# Altium schematic sheet UART Interface.SchDoc
size A
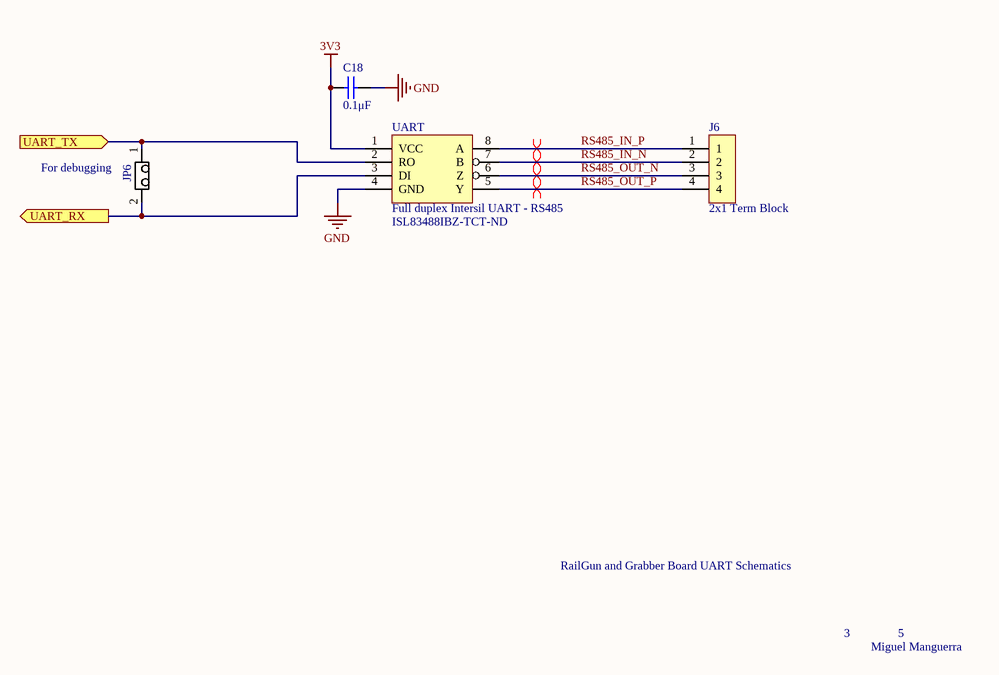
[diagram p0: UART Interface.SchDoc]

## Parts
C18  0.1μF  [CAPC1608N(0603")]
J6  2x1 Term Block  [4X1 Terminal Block]
JP6  1X2 Pin Head  [2X1 Males Header]  (value not drawn)
UART  Full duplex Intersil UART - RS485  Supplier Part Number 1: ISL83488IBZ-TCT-ND  [SOIC-SN8_M]

## Ports
UART_RX (out), UART_TX (in)

## Nets
3V3: C18.2(Cathode) UART.1(VCC)
GND: C18.1(Anode) UART.4(GND)
RS485_IN_N: J6.2 UART.7(B)
RS485_IN_P: J6.1 UART.8(A)
RS485_OUT_N: J6.3 UART.6(Z)
RS485_OUT_P: J6.4 UART.5(Y)
UART_RX: JP6.2 UART.3(DI) ; port UART_RX
UART_TX: JP6.1 UART.2(RO) ; port UART_TX

## Layout directives
differential pair: RS485_IN_N, RS485_IN_P, RS485_OUT_N, RS485_OUT_P

## Notes on the sheet
- (near JP6) For debugging
- RailGun and Grabber Board UART Schematics
- 3
- 5
- Miguel Manguerra

## Library data of the parts
C18 = 0.1uF 100V 0603 SMD, Ceramic: Capacitor, Ceramic, 100V, +/- 10%, 0603 SMD, X7R; MFG: TDK; MFG#: CGA3E3X7S2A104K080AB; Published: 16-04-26; Publisher: AUVic; PackageDescription: Chip Capacitor; Value: 0.1μF; Created By: Ashwin Sira; Supplier 1: Digi-Key; Supplier Part Number 1: 445-6938-1-ND
J6 = 4x1 Terminal Block: Made by: Andy Bates; Supplier 1: Digikey; Supplier Part Number 1: ED2742-ND
JP6 = 1x2 Male Header: Made By: Andy Bates; Supplier 1: Digi-Key; Supplier Part Number 1: 952-3073-ND
UART = Full duplex Intersil UART - RS485: Made By: Andy Bates; Created On: 2016/09/08; Supplier 1: Digi-Key